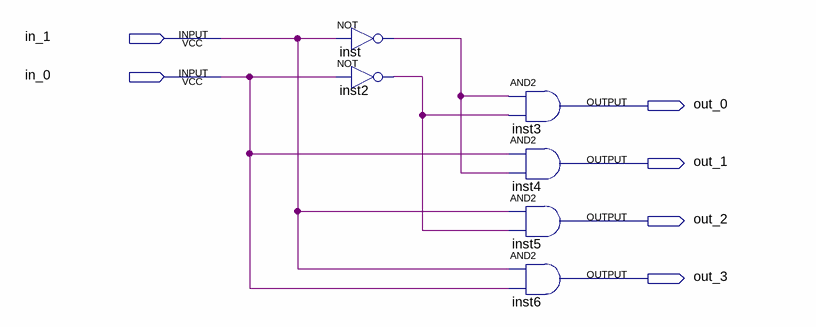
[diagram p0: schematic sheet]
// Quartus schematic decodificador.bdf as structural Verilog: 6 symbols, 6 pins
module decodificador (
  input  in_1,
  input  in_0,
  output out_0,
  output out_1,
  output out_2,
  output out_3
);

  wire inst2_out, inst_out;

  not inst (inst_out, in_1);
  not inst2 (inst2_out, in_0);
  and inst3 (out_0, inst_out, inst2_out);
  and inst4 (out_1, in_0, inst_out);
  and inst5 (out_2, in_1, inst2_out);
  and inst6 (out_3, in_1, in_0);
endmodule
